# EAGLE design CAMGO (EAGLE 6.6.0)
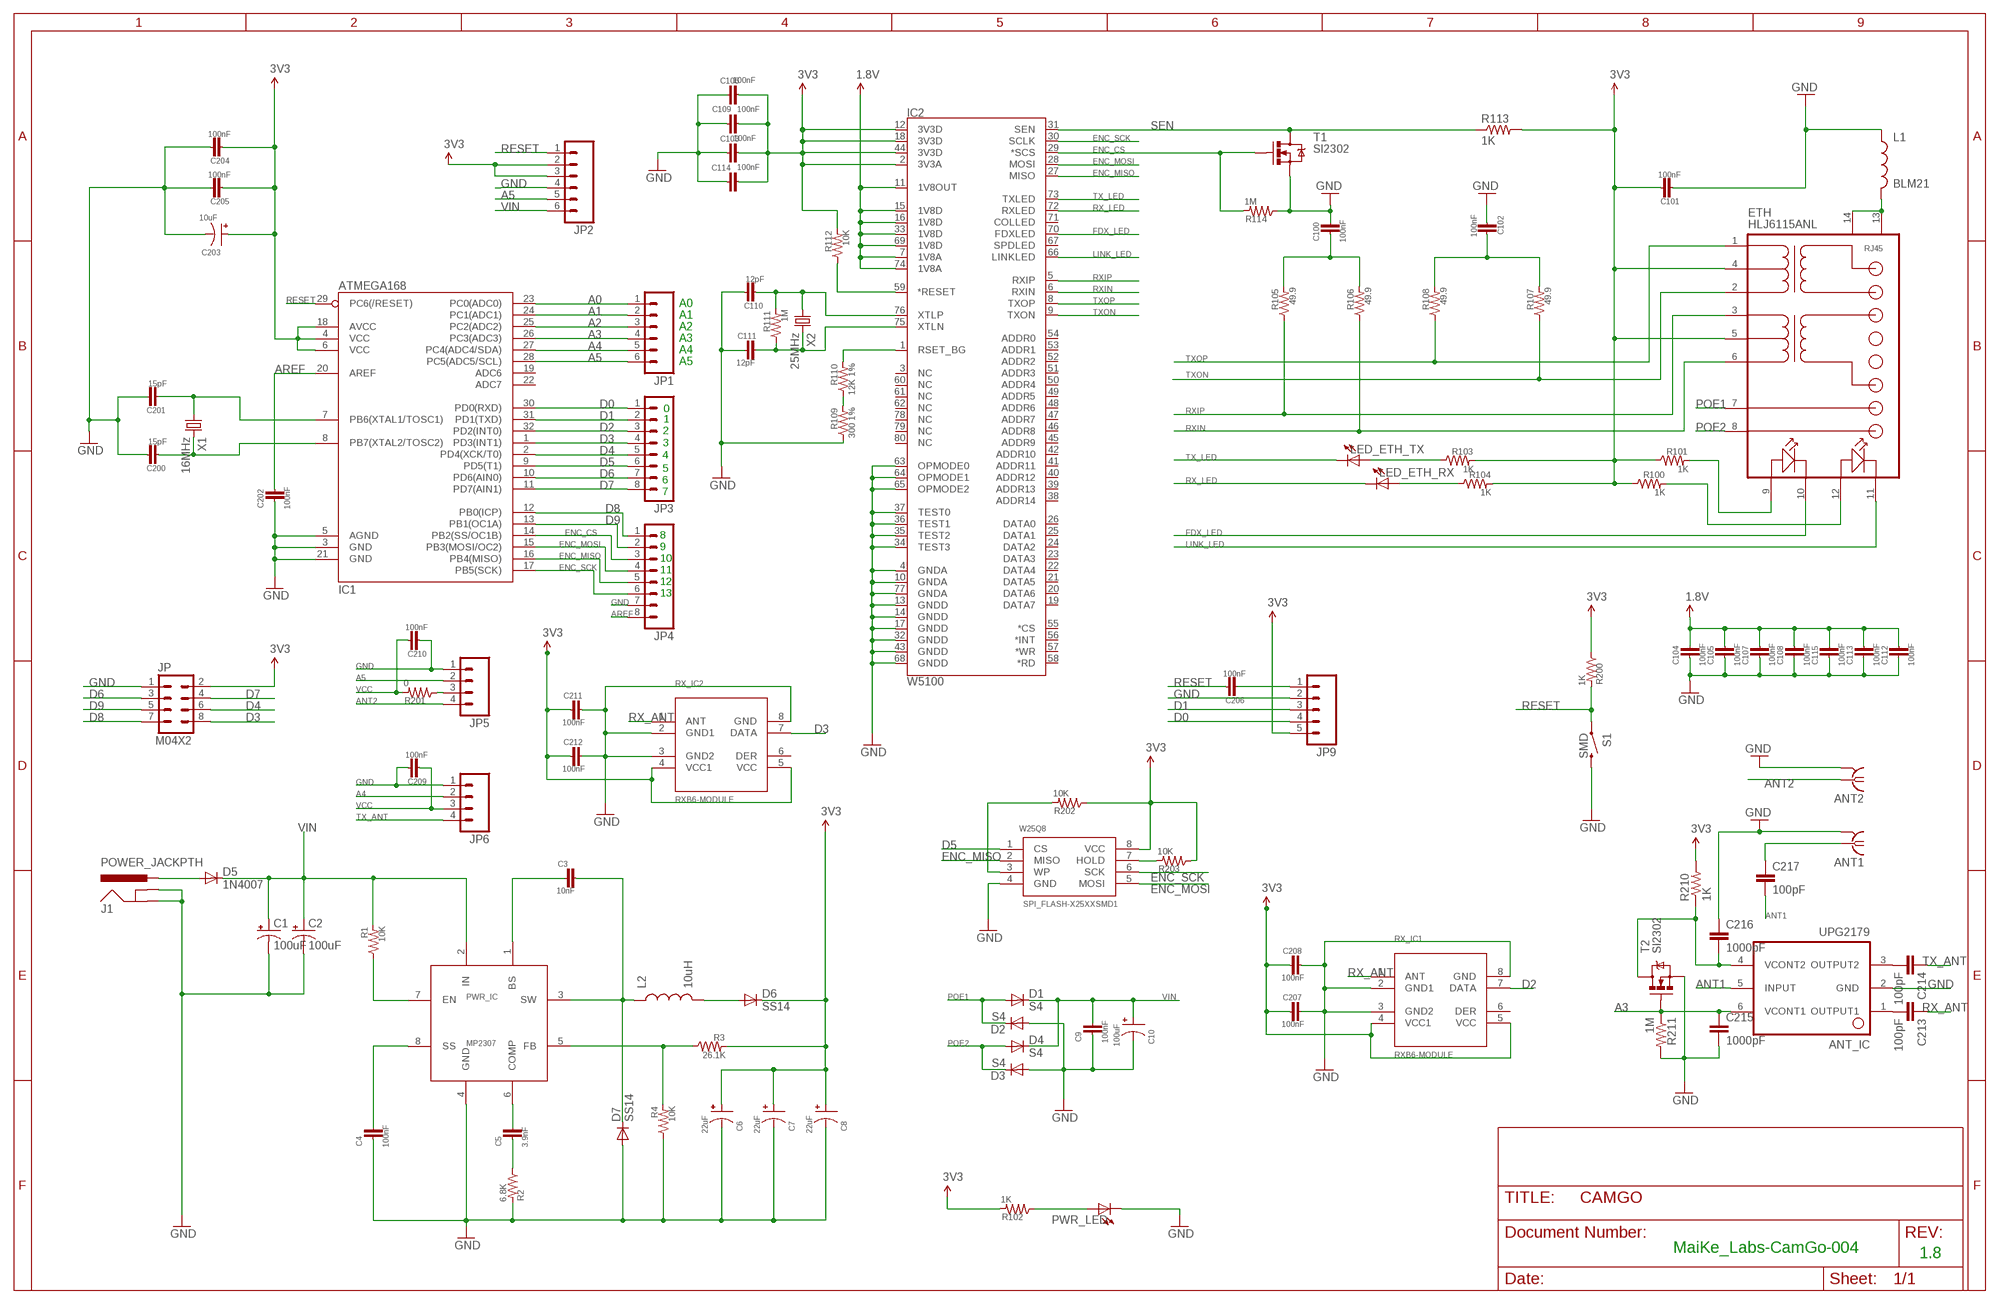
[diagram p0: schematic, sheet 1]

## Parts
ANT1  SMA--KE  [SMA-KE]
ANT2  SMA--KE  [SMA-KE]
ANT_IC  UPG2179  [SOT363]
C1  100uF  CAP_POLF80  [NIPPON_F80]
C2  100uF  CAP_POLF80  [NIPPON_F80]
C3  10nF  CAP0603-CAP  [0603-CAP]
C4  100nF  CAP0603-CAP  [0603-CAP]
C5  3.9nF  CAP0603-CAP  [0603-CAP]
C6  22uF  CAP_POL1206  [EIA3216]
C7  22uF  CAP_POL1206  [EIA3216]
C8  22uF  CAP_POL1206  [EIA3216]
C9  100nF  CAP0603-CAP  [0603-CAP]
C10  100uF  CAP_POLF80  [NIPPON_F80]
C100  100nF  CAP0603-CAP  [0603-CAP]
C101  100nF  CAP0603-CAP  [0603-CAP]
C102  100nF  CAP0603-CAP  [0603-CAP]
C103  100nF  CAP0603-CAP  [0603-CAP]
C104  100nF  CAP0603-CAP  [0603-CAP]
C105  100nF  CAP0603-CAP  [0603-CAP]
C106  100nF  CAP0603-CAP  [0603-CAP]
C107  100nF  CAP0603-CAP  [0603-CAP]
C108  100nF  CAP0603-CAP  [0603-CAP]
C109  100nF  CAP0603-CAP  [0603-CAP]
C110  12pF  CAP0603-CAP  [0603-CAP]
C111  12pF  CAP0603-CAP  [0603-CAP]
C112  100nF  CAP0603-CAP  [0603-CAP]
C113  100nF  CAP0603-CAP  [0603-CAP]
C114  100nF  CAP0603-CAP  [0603-CAP]
C115  100nF  CAP0603-CAP  [0603-CAP]
C200  15pF  CAP0603-CAP  [0603-CAP]
C201  15pF  CAP0603-CAP  [0603-CAP]
C202  100nF  CAP0603-CAP  [0603-CAP]
C203  10uF  CAP_POL1206  [EIA3216]
C204  100nF  CAP0603-CAP  [0603-CAP]
C205  100nF  CAP0603-CAP  [0603-CAP]
C206  100nF  CAP0603-CAP  [0603-CAP]
C207  100nF  CAP0603-CAP  [0603-CAP]
C208  100nF  CAP0603-CAP  [0603-CAP]
C209  100nF  CAP0603-CAP  [0603-CAP]
C210  100nF  CAP0603-CAP  [0603-CAP]
C211  100nF  CAP0603-CAP  [0603-CAP]
C212  100nF  CAP0603-CAP  [0603-CAP]
C213  100pF  CAP0603-CAP  [0603-CAP]
C214  100pF  CAP0603-CAP  [0603-CAP]
C215  1000pF  CAP0603-CAP  [0603-CAP]
C216  1000pF  CAP0603-CAP  [0603-CAP]
C217  100pF  CAP0603-CAP  [0603-CAP]
D1  S4  DIODESOD  [SOD-323]
D2  S4  DIODESOD  [SOD-323]
D3  S4  DIODESOD  [SOD-323]
D4  S4  DIODESOD  [SOD-323]
D5  1N4007  DIODESMB  [SMB-DIODE]
D6  SS14  DIODESOD  [SOD-323]
D7  SS14  DIODESOD  [SOD-323]
ETH  HLJ6115ANL  [HR911105A]
IC1  ATMEGA168  [TQFP32-08]
IC2  W5100  [LQFP-80]
J1  POWER_JACKPTH  [POWER_JACK_PTH]
JP  M04X2  [2X4]
JP1  M06SIP  [1X06]
JP2  M06SIP  [1X06]
JP3  M081X08  [1X08]
JP4  M081X08  [1X08]
JP5  M04PTH  [1X04]
JP6  M04PTH  [1X04]
JP9  M05PTH  [1X05]
L1  BLM21  INDUCTOR0805  [0805]
L2  10uH  INDUCTORCR54  [CR54]
LED_ETH_RX  LED0603  [LED-0603]
LED_ETH_TX  LED0603  [LED-0603]
PWR_IC  MP2307  MP2302  [SOIC8]
PWR_LED  LED0603  [LED-0603]
R1  10K  RESISTOR0603-RES  [0603-RES]
R2  6.8K  RESISTOR0603-RES  [0603-RES]
R3  26.1K  RESISTOR0603-RES  [0603-RES]
R4  10K  RESISTOR0603-RES  [0603-RES]
R100  1K  RESISTOR0603-RES  [0603-RES]
R101  1K  RESISTOR0603-RES  [0603-RES]
R102  1K  RESISTOR0603-RES  [0603-RES]
R103  1K  RESISTOR0603-RES  [0603-RES]
R104  1K  RESISTOR0603-RES  [0603-RES]
R105  49.9  RESISTOR0603-RES  [0603-RES]
R106  49.9  RESISTOR0603-RES  [0603-RES]
R107  49.9  RESISTOR0603-RES  [0603-RES]
R108  49.9  RESISTOR0603-RES  [0603-RES]
R109  300 1%  RESISTOR0603-RES  [0603-RES]
R110  12K 1%  RESISTOR0603-RES  [0603-RES]
R111  1M  RESISTOR0603-RES  [0603-RES]
R112  10K  RESISTOR0603-RES  [0603-RES]
R113  1K  RESISTOR0603-RES  [0603-RES]
R114  1M  RESISTOR0603-RES  [0603-RES]
R200  1K  RESISTOR0603-RES  [0603-RES]
R201  0  RESISTOR0603-RES  [0603-RES]
R202  10K  RESISTOR0603-RES  [0603-RES]
R203  10K  RESISTOR0603-RES  [0603-RES]
R210  1K  RESISTOR0603-RES  [0603-RES]
R211  1M  RESISTOR0603-RES  [0603-RES]
RX_IC1  RXB6-MODULE  [RXB6-MODULE]
RX_IC2  RXB6-MODULE  [RXB6-MODULE]
S1  SMD  SWITCH-MOMENTARY-2-SMD-1101NE  [TACTILE-SWITCH-1101NE]
T1  SI2302  -MOSFET-N-SMD  [SOT23-3]
T2  SI2302  -MOSFET-N-SMD  [SOT23-3]
W25Q8  SPI_FLASH-X25XXSMD1  [SO08-EIAJ]
X1  16MHz  CRYSTALHC49US  [HC49US]
X2  25MHz  CRYSTALHC49US  [HC49US]

## Nets
1.8V: C104.1 C105.1 C107.1 C108.1 C112.1 C113.1 C115.1 IC2.7(1V8A) IC2.11(1V8OUT) IC2.15(1V8D) IC2.16(1V8D) IC2.33(1V8D) IC2.69(1V8D) IC2.74(1V8A)
A0: IC1.23(PC0(ADC0)) JP1.1
A1: IC1.24(PC1(ADC1)) JP1.2
A2: IC1.25(PC2(ADC2)) JP1.3
A3: ANT_IC.6(VCONT1) C215.1 IC1.26(PC3(ADC3)) JP1.4 R211.1 T2.1(G)
A4: IC1.27(PC4(ADC4/SDA)) JP1.5 JP6.2
A5: IC1.28(PC5(ADC5/SCL)) JP1.6 JP2.5 JP5.2
ANT1: ANT_IC.5(INPUT) C217.2
ANT2: ANT2.1 JP5.4
AREF: C202.1 IC1.20(AREF) JP4.8
D0: IC1.30(PD0(RXD)) JP3.1 JP9.4
D1: IC1.31(PD1(TXD)) JP3.2 JP9.3
D2: IC1.32(PD2(INT0)) JP3.3 RX_IC1.7(DATA)
D3: IC1.1(PD3(INT1)) JP3.4 JP.8 RX_IC2.7(DATA)
D4: IC1.2(PD4(XCK/T0)) JP3.5 JP.6
D5: IC1.9(PD5(T1)) JP3.6 W25Q8.1(CS)
D6: IC1.10(PD6(AIN0)) JP3.7 JP.3
D7: IC1.11(PD7(AIN1)) JP3.8 JP.4
D8: IC1.12(PB0(ICP)) JP4.1 JP.7
D9: IC1.13(PB1(OC1A)) JP4.2 JP.5
ENC_CS: IC1.14(PB2(SS/OC1B)) IC2.29(*SCS) JP4.3 R114.2 T1.1(G)
ENC_MISO: IC1.16(PB4(MISO)) IC2.27(MISO) JP4.5 W25Q8.2(MISO)
ENC_MOSI: IC1.15(PB3(MOSI/OC2)) IC2.28(MOSI) JP4.4 W25Q8.5(MOSI)
ENC_SCK: IC1.17(PB5(SCK)) IC2.30(SCLK) JP4.6 W25Q8.6(SCK)
FDX_LED: ETH.10 IC2.70(FDXLED)
GND: ANT1.G@1(GND) ANT2.G@1(GND) ANT_IC.2(GND) C1.- C2.- C4.2 C6.C(-) C7.C(-) C8.C(-) C9.2 C10.- C100.1 C101.2 C102.2 C103.2 C104.2 C105.2 C106.2 C107.2 C108.2 C109.1 C110.1 C111.2 C112.2 C113.2 C114.1 C115.2 C200.1 C201.1 C202.2 C203.C(-) C204.1 C205.1 C207.1 C208.1 C209.1 C210.2 C211.1 C212.1 C215.2 C216.1 D2.2(A) D3.2(A) D7.2(A) IC1.3(GND) IC1.5(AGND) IC1.21(GND) IC2.4(GNDA) IC2.10(GNDA) IC2.13(GNDD) IC2.14(GNDD) IC2.17(GNDD) IC2.32(GNDD) IC2.34(TEST3) IC2.35(TEST2) IC2.36(TEST1) IC2.37(TEST0) IC2.43(GNDD) IC2.63(OPMODE0) IC2.64(OPMODE1) IC2.65(OPMODE2) IC2.68(GNDD) IC2.77(GNDA) J1.GND J1.GNDBREAK JP2.4 JP4.7 JP5.1 JP6.1 JP9.2 JP.1 L1.1 PWR_IC.4(GND) PWR_LED.C R2.2 R4.1 R109.1 R114.1 R211.2 RX_IC1.2(GND1) RX_IC1.3(GND2) RX_IC1.8(GND) RX_IC2.2(GND1) RX_IC2.3(GND2) RX_IC2.8(GND) S1.P$2 T1.2(S) T2.2(S) W25Q8.4(GND)
LINK_LED: ETH.11 IC2.66(LINKLED)
N$1: ETH.9 R101.2
N$2: C201.2 IC1.7(PB6(XTAL1/TOSC1)) X1.1
N$3: C200.2 IC1.8(PB7(XTAL2/TOSC2)) X1.2
N$4: C110.2 IC2.76(XTLP) R111.2 X2.1
N$5: R202.2 W25Q8.3(WP)
N$6: C206.2 JP9.1
N$7: D5.A J1.PWR
N$8: C111.1 IC2.75(XTLN) R111.1 X2.2
N$9: C3.2 PWR_IC.1(BS)
N$10: PWR_IC.7(EN) R1.1
N$11: PWR_LED.A R102.1
N$12: C4.1 PWR_IC.8(SS)
N$13: IC2.1(RSET_BG) R110.2
N$14: R109.2 R110.1
N$15: ETH.12 R100.2
N$16: PWR_IC.5(FB) R3.1 R4.2
N$17: C102.1 R107.2 R108.2
N$18: C5.1 PWR_IC.6(COMP)
N$19: C5.2 R2.1
N$20: C3.1 D7.1(C) L2.P$1 PWR_IC.3(SW)
N$22: LED_ETH_TX.A R103.1
N$23: C100.2 R105.2 R106.2
N$24: LED_ETH_RX.A R104.1
N$28: D6.2(A) L2.P$2
N$34: JP5.3 R201.1
N$35: R203.2 W25Q8.7(HOLD)
N$36: ETH.13 ETH.14 L1.2
N$37: ANT_IC.4(VCONT2) C216.2 R210.1 T2.3(D)
N$38: ANT1.1 C217.1
N$39: ANT_IC.1(OUTPUT1) C213.2
N$40: ANT_IC.3(OUTPUT2) C214.2
POE1: D1.2(A) D2.1(C) ETH.7
POE2: D3.1(C) D4.2(A) ETH.8
RESET: C206.1 IC1.29(PC6(/RESET)) IC2.59(*RESET) JP2.1 R112.1 R200.2 S1.P$1
RX_ANT: C213.1 RX_IC1.1(ANT) RX_IC2.1(ANT)
RX_LED: IC2.72(RXLED) LED_ETH_RX.C
RXIN: ETH.6 IC2.6(RXIN) R106.1
RXIP: ETH.3 IC2.5(RXIP) R105.1
SEN: IC2.31(SEN) R113.1 T1.3(D)
TX_ANT: C214.1 JP6.4
TX_LED: IC2.73(TXLED) LED_ETH_TX.C
TXON: ETH.2 IC2.9(TXON) R107.1
TXOP: ETH.1 IC2.8(TXOP) R108.1
VCC: C6.A(+) C7.A(+) C8.A(+) C101.1 C103.1 C106.1 C109.2 C114.2 C203.A(+) C204.2 C205.2 C207.2 C208.2 C209.2 C210.1 C211.2 C212.2 D6.1(C) ETH.4 ETH.5 IC1.4(VCC) IC1.6(VCC) IC1.18(AVCC) IC2.2(3V3A) IC2.12(3V3D) IC2.18(3V3D) IC2.44(3V3D) JP2.2 JP2.3 JP6.3 JP9.5 JP.2 R3.2 R100.1 R101.1 R102.2 R103.2 R104.2 R112.2 R113.2 R200.1 R201.2 R202.1 R203.1 R210.2 RX_IC1.4(VCC1) RX_IC1.5(VCC) RX_IC2.4(VCC1) RX_IC2.5(VCC) W25Q8.8(VCC) ; supply symbol labelled 3V3
VIN: C1.+ C2.+ C9.1 C10.+ D1.1(C) D4.1(C) D5.C JP2.6 PWR_IC.2(IN) R1.2
Unconnected: IC1.19(ADC6) IC1.22(ADC7) IC2.3(NC) IC2.19(DATA7) IC2.20(DATA6) IC2.21(DATA5) IC2.22(DATA4) IC2.23(DATA3) IC2.24(DATA2) IC2.25(DATA1) IC2.26(DATA0) IC2.38(ADDR14) IC2.39(ADDR13) IC2.40(ADDR12) IC2.41(ADDR11) IC2.42(ADDR10) IC2.45(ADDR9) IC2.46(ADDR8) IC2.47(ADDR7) IC2.48(ADDR6) IC2.49(ADDR5) IC2.50(ADDR4) IC2.51(ADDR3) IC2.52(ADDR2) IC2.53(ADDR1) IC2.54(ADDR0) IC2.55(*CS) IC2.56(*INT) IC2.57(*WR) IC2.58(*RD) IC2.60(NC) IC2.61(NC) IC2.62(NC) IC2.67(SPDLED) IC2.71(COLLED) IC2.78(NC) IC2.79(NC) IC2.80(NC) RX_IC1.6(DER) RX_IC2.6(DER)

## Notes on the sheet
- A0
- A1
- A2
- A3
- A4
- A5
- 0
- 1
- 2
- 3
- 4
- 5
- 6
- 7
- 8
- 9
- 10
- 11
- 12
- 13
- MaiKe_Labs-CamGo-004
- 1.8

## Power pins joined to a net without a drawn wire
GND: ANT1.G@2(GND) ANT1.G@3(GND) ANT1.G@4(GND) ANT2.G@2(GND) ANT2.G@3(GND) ANT2.G@4(GND)

## Library data of the parts
ANT1 ANT2 = dtoy-RF:SMA-: SMA 50 Ohm End Launch Jack Receptacle - Round Contact Johnson Components Source: www.johnsoncomponents.com .. J502-ND.pdf
ANT_IC = ehl:UPG2179
C1 C2 = SparkFun:CAP_POL: Capacitor Polarized
C3-C5 C9 C100-C115 C200-C202 C204-C212 = digital-toy:CAP: Capacitor Standard 0603 ceramic capacitor, and 0.1" leaded capacitor.
C6-C8 C10 C203 = digital-toy:CAP_POL: Capacitor Polarized
C213-C217 = SparkFun:CAP: Capacitor Standard 0603 ceramic capacitor, and 0.1" leaded capacitor.
D1-D4 = ehl:DIODE: Diode These are standard reverse protection diodes and small signal diodes. SMA package can handle up to about 1A. SOD-323 can handle about 200mA. What the SOD-323 package when ordering, there are some mfgs out there that are 5-pin packages.
D5-D7 = SparkFun:DIODE: Diode These are standard reverse protection diodes and small signal diodes. SMA package can handle up to about 1A. SOD-323 can handle about 200mA. What the SOD-323 package when ordering, there are some mfgs out there that are 5-pin packages.
ETH = ehl:HLJ6115ANL
IC1 = SparkFun:ATMEGA168
IC2 = SparkFun:W5100: WIZnet W5100 TCP/IP PHY Embedded Chip See SparkFun catalog # COM-09471 Package: LQFP-80,10x10mm, 0.4mm pitch
J1 = digital-toy:POWER_JACK: Power Jack This is the standard 5.5mm barrel jack for power. The PTH is the most common, proven, reliable, footprint. All others are experimental. The Slot footprint only works if the mill layer is transmitted to the PCB fab house so be warned. Spark Fun Electronics SKU : PRT-00119. Mating wall wart : TOL-00298 (and others)
JP = SparkFun:M04X2
JP1 JP2 = SparkFun:M06: Header 6 Standard 6-pin 0.1" header. Use with straight break away headers (SKU : PRT-00116), right angle break away headers (PRT-00553), swiss pins (PRT-00743), machine pins (PRT-00117), and female headers (PRT-00115). Molex polarized connector foot print use with SKU : PRT-08094 with associated crimp pins and housings. NOTES ON THE VARIANTS LOCK and LOCK_LONGPADS... This footprint was designed to help hold the alignment of a through-hole component (i.e. 6-pin header) while soldering it into place. You may notice that each hole has been shifted either up or down by 0.005 of an inch from it's more standard position (which is a perfectly straight line). This slight alteration caused the pins (the squares in the middle) to touch the edges of the holes. Because they are alternating, it causes a "brace" to hold the component in place. 0.005 has proven to be the perfect amount of "off-center" position when using our standard breakaway headers. Although looks a little odd when you look at the bare footprint, once you have a header in there, the alteration is very hard to notice. Also, if you push a header all the way into place, it is covered up entirely on the bottom side. This idea of altering the position of holes to aid alignment will be further integrated into the Sparkfun Library for other footprints. It can help hold any component with 3 or more connection pins.
JP3 JP4 = SparkFun:M08: Header 8 Standard 8-pin 0.1" header. Use with straight break away headers (SKU : PRT-00116), right angle break away headers (PRT-00553), swiss pins (PRT-00743), machine pins (PRT-00117), and female headers (PRT-00115).
JP5 JP6 = SparkFun:M04: Header 4 Standard 4-pin 0.1" header. Use with straight break away headers (SKU : PRT-00116), right angle break away headers (PRT-00553), swiss pins (PRT-00743), machine pins (PRT-00117), and female headers (PRT-00115). Molex polarized connector foot print use with SKU : PRT-08231 with associated crimp pins and housings. 1MM SMD Version SKU: PRT-10208
JP9 = SparkFun:M05: Header 5 Standard 5-pin 0.1" header. Use with straight break away headers (SKU : PRT-00116), right angle break away headers (PRT-00553), swiss pins (PRT-00743), machine pins (PRT-00117), and female headers (PRT-00115). Molex polarized connector foot print use with SKU : PRT-08230 with associated crimp pins and housings.
L1 L2 = SparkFun:INDUCTOR: Inductors Basic Inductor/Choke - 0603 and 1206. Footprints are not proven and vary greatly between part numbers.
LED_ETH_RX LED_ETH_TX PWR_LED = digital-toy:LED: LEDs Standard schematic elements and footprints for 5mm, 3mm, 1206, and 0603 sized LEDs. 5mm - Spark Fun Electronics SKU : COM-00529 (and others) copy led.lbr 0805 led here, by hyl digital-toy. 2010.6.29
PWR_IC = ehl:MP2302: MP2302 The MP2307 is a monolithic synchronous buck regulator. The device integrates 100mΩ MOSFETS that provide 3A of continuous load current over a wide operating input voltage of 4.75V to 23V. Current mode control provides fast transient response and cycle-by-cycle current limit. FEATURES 3A Continuous Output Current 4A Peak Output Current Wide 4.75V to 23V Operating Input Range Integrated 100mΩ Power MOSFET Switches Output Adjustable from 0.925V to 20V Up to 95% Efficiency Programmable Soft-Start Stable with Low ESR Ceramic Output Capacitors Fixed 340KHz Frequency Cycle-by-Cycle Over Current Protection Input Under Voltage Lockout Thermally Enhanced 8-Pin SOIC Package APPLICATIONS Distributed Power Systems Networking Systems FPGA, DSP, ASIC Power Supplies Green Electronics/Appliances Notebook Computers
R1-R4 R100-R112 R114 R200-R203 = digital-toy:RESISTOR: Resistor
R113 R210 R211 = SparkFun:RESISTOR: Resistor
RX_IC1 RX_IC2 = ehl:RXB6-MODULE
S1 = SparkFun:SWITCH-MOMENTARY-2
T1 T2 = digital-toy:*-MOSFET-N
W25Q8 = SparkFun:SPI_FLASH-X25XX: 8pin SPI Flash series x25xx. Works with devices like W25X32 and BR25L32
X1 X2 = SparkFun:CRYSTAL: Crystals Various standard crystals. Proven footprints. Spark Fun Electronics SKU : COM-00534

## Board
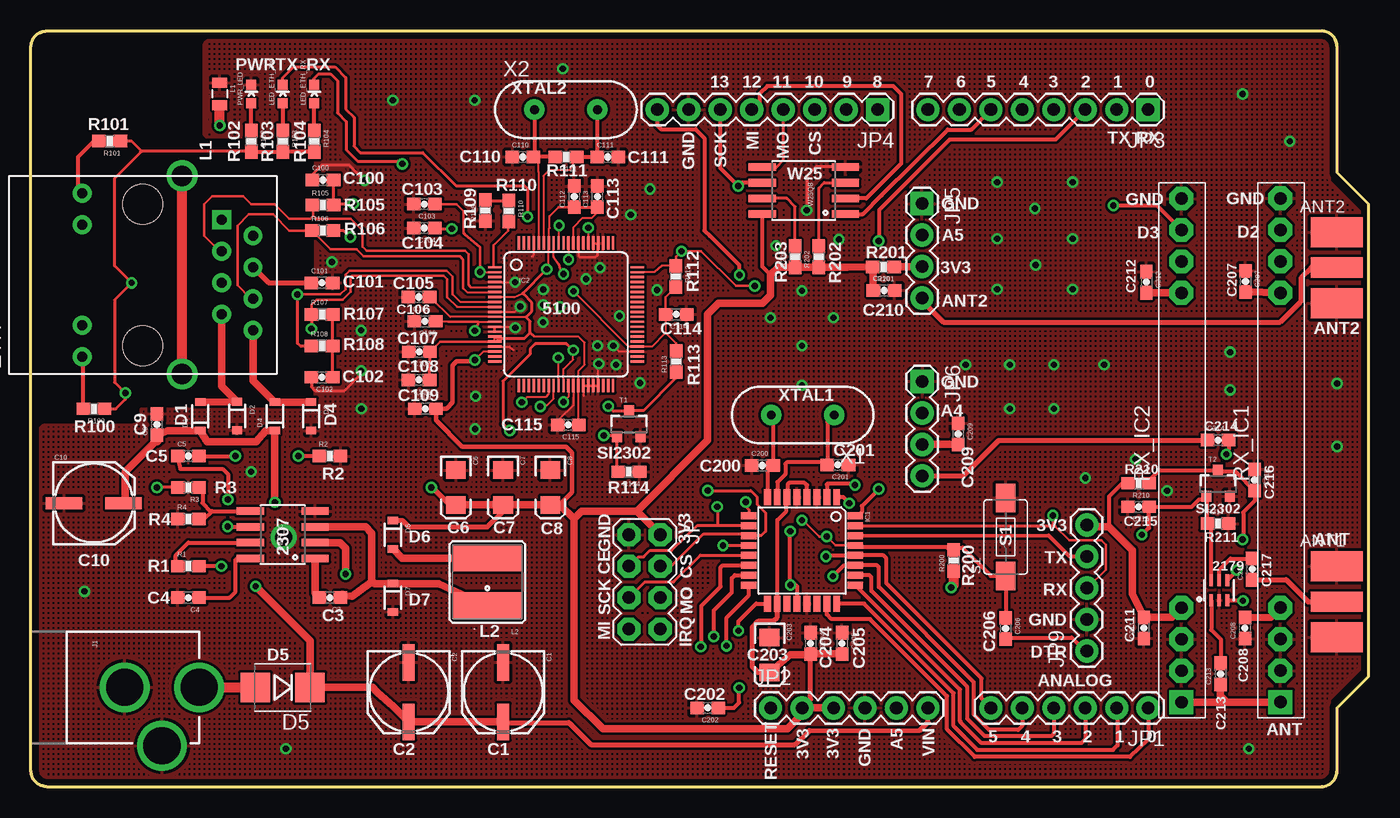
[diagram p1: board, top side]
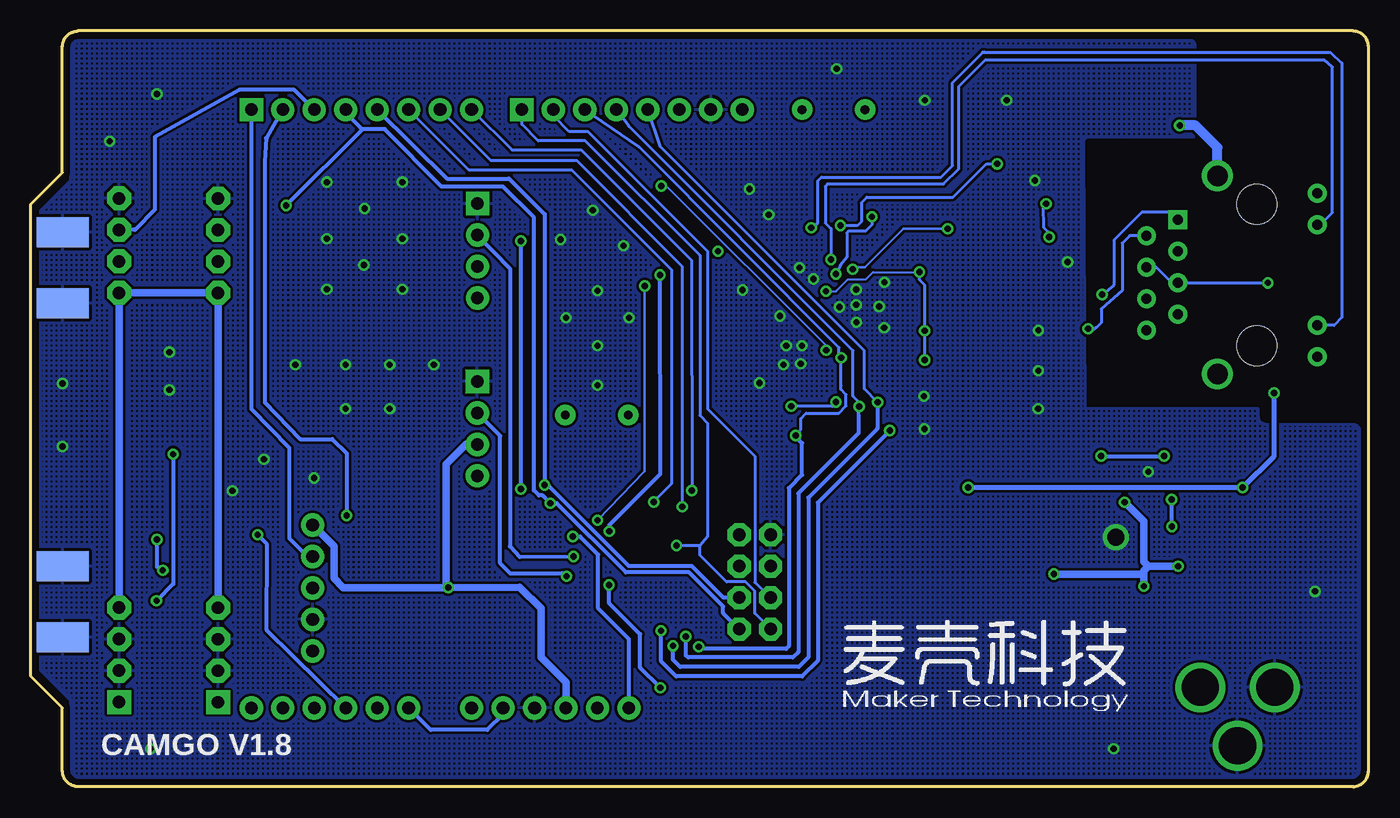
[diagram p2: board, bottom side, seen from below]

Size 107.95 x 60.96 mm. Coordinates in mm from the lower left corner, seen from the top.
Outline: 1.27,0 arc-90 0,1.27 0,59.69 arc-90 1.27,60.96 104.14,60.96 arc-90 105.41,59.69 105.41,49.53 107.95,46.99 107.95,8.89 105.41,6.35 105.41,1.27 arc-90 104.14,0 1.27,0
Copper layers (1*16): Top 0.035mm / dielectric 1.5mm / Bottom 0.035mm
Design rules "jackslab-camgo *": minimum track width 6mil, minimum drill 12mil, track to track 8mil, track to pad 8mil, pad to pad 8mil, via to via 8mil, smd to smd 6mil, copper to edge 20mil, drill to drill 8mil, minimum pad ring 10mil, minimum via ring 8mil, stop-mask expansion 0mil, vias tented up to drill 30mil, thermal gap 10mil

### Footprints (pad centres in the part's own frame; a part is rotated, then mirrored left to right if it is on the bottom)
SMA-KE = smd 4.191 x 1.651: 1 -2.115,0 | smd 4.191 x 2.413: G@1 -2.115,-2.86; G@2 -2.115,2.86 | smd 4.191 x 2.413 bottom: G@3 -2.115,-2.86; G@4 -2.115,2.86
SOT363 = smd 0.3 x 0.99: 1 -0.65,-0.8; 2 0,-0.8; 3 0.65,-0.8; 4 0.65,0.81; 5 0,0.81; 6 -0.65,0.81
NIPPON_F80 = smd 2.95 x 1: + 2.4,0; - -2.4,0
0603-CAP = smd 1.1 x 1: 1 -0.85,0; 2 0.85,0
EIA3216 = smd 1.4 x 1.6: A 1.4,0; C -1.4,0
SOD-323 = smd 0.63 x 0.83: 1 -1.15,0; 2 1.15,0
SMB-DIODE = smd 2.4 x 2.4: A 2.2,0; C -2.2,0
HR911105A = drill 0.813 pad 1.524 square: 1 4.445,-6.35 | drill 0.813 pad 1.524: 2 3.175,-8.89; 3 1.905,-6.35; 4 0.635,-8.89; 5 -0.635,-6.35; 6 -1.905,-8.89; 7 -3.175,-6.35; 8 -4.445,-8.89; 9 6.604,4.902; 10 4.064,4.902; 11 -4.064,4.902; 12 -6.604,4.902 | drill 1.651 pad 2.159: 13 8.001,-3.175; 14 -8.001,-3.175 | hole 3.2: 5.715,0; -5.715,0
TQFP32-08 = smd 1.27 x 0.559: 1 -4.293,2.8; 2 -4.293,2; 3 -4.293,1.2; 4 -4.293,0.4; 5 -4.293,-0.4; 6 -4.293,-1.2; 7 -4.293,-2; 8 -4.293,-2.8; 17 4.293,-2.8; 18 4.293,-2; 19 4.293,-1.2; 20 4.293,-0.4; 21 4.293,0.4; 22 4.293,1.2; 23 4.293,2; 24 4.293,2.8 | smd 0.559 x 1.27: 9 -2.8,-4.293; 10 -2,-4.293; 11 -1.2,-4.293; 12 -0.4,-4.293; 13 0.4,-4.293; 14 1.2,-4.293; 15 2,-4.293; 16 2.8,-4.293; 25 2.8,4.293; 26 2,4.293; 27 1.2,4.293; 28 0.4,4.293; 29 -0.4,4.293; 30 -1.2,4.293; 31 -2,4.293; 32 -2.8,4.293
LQFP-80 = smd 0.19 x 1.1: 1 -3.8,-5.75; 2 -3.4,-5.75; 3 -3,-5.75; 4 -2.6,-5.75; 5 -2.2,-5.75; 6 -1.8,-5.75; 7 -1.4,-5.75; 8 -1,-5.75; 9 -0.6,-5.75; 10 -0.2,-5.75; 11 0.2,-5.75; 12 0.6,-5.75; 13 1,-5.75; 14 1.4,-5.75; 15 1.8,-5.75; 16 2.2,-5.75; 17 2.6,-5.75; 18 3,-5.75; 19 3.4,-5.75; 20 3.8,-5.75; 41 3.8,5.75; 42 3.4,5.75; 43 3,5.75; 44 2.6,5.75; 45 2.2,5.75; 46 1.8,5.75; 47 1.4,5.75; 48 1,5.75; 49 0.6,5.75; 50 0.2,5.75; 51 -0.2,5.75; 52 -0.6,5.75; 53 -1,5.75; 54 -1.4,5.75; 55 -1.8,5.75; 56 -2.2,5.75; 57 -2.6,5.75; 58 -3,5.75; 59 -3.4,5.75; 60 -3.8,5.75 | smd 1.1 x 0.19: 21 5.75,-3.8; 22 5.75,-3.4; 23 5.75,-3; 24 5.75,-2.6; 25 5.75,-2.2; 26 5.75,-1.8; 27 5.75,-1.4; 28 5.75,-1; 29 5.75,-0.6; 30 5.75,-0.2; 31 5.75,0.2; 32 5.75,0.6; 33 5.75,1; 34 5.75,1.4; 35 5.75,1.8; 36 5.75,2.2; 37 5.75,2.6; 38 5.75,3; 39 5.75,3.4; 40 5.75,3.8; 61 -5.75,3.8; 62 -5.75,3.4; 63 -5.75,3; 64 -5.75,2.6; 65 -5.75,2.2; 66 -5.75,1.8; 67 -5.75,1.4; 68 -5.75,1; 69 -5.75,0.6; 70 -5.75,0.2; 71 -5.75,-0.2; 72 -5.75,-0.6; 73 -5.75,-1; 74 -5.75,-1.4; 75 -5.75,-1.8; 76 -5.75,-2.2; 77 -5.75,-2.6; 78 -5.75,-3; 79 -5.75,-3.4; 80 -5.75,-3.8
POWER_JACK_PTH = drill 2.997: GND 0,7.7; GNDBREAK 4.7,10.7; PWR 0,13.7
2X4 = drill 1.016 pad 1.88 octagon: 1 -3.81,-1.27; 2 -3.81,1.27; 3 -1.27,-1.27; 4 -1.27,1.27; 5 1.27,-1.27; 6 1.27,1.27; 7 3.81,-1.27; 8 3.81,1.27
1X06 = drill 1.016 pad 1.88: 1 0,0; 2 2.54,0; 3 5.08,0; 4 7.62,0; 5 10.16,0; 6 12.7,0
1X08 = drill 1.016 pad 1.88 square: 1 0,0 | drill 1.016 pad 1.88: 2 2.54,0; 3 5.08,0; 4 7.62,0; 5 10.16,0; 6 12.7,0; 7 15.24,0; 8 17.78,0
1X04 = drill 1.016 pad 1.88 square: 1 0,0 | drill 1.016 pad 1.88: 2 2.54,0; 3 5.08,0; 4 7.62,0
1X05 = drill 1.016 pad 1.88: 1 0,0; 2 2.54,0; 3 5.08,0; 4 7.62,0; 5 10.16,0
0805 = smd 0.8 x 1.2: 1 -0.9,0; 2 0.9,0
CR54 = smd 5.5 x 2.15: P$1 0,1.92; P$2 0,-1.92
LED-0603 = smd 0.8 x 0.8: A 0,-0.75; C 0,0.75
SOIC8 = smd 0.61 x 2.21: 1 -1.905,-2.616; 2 -0.635,-2.616; 3 0.635,-2.616; 4 1.905,-2.616; 5 1.905,2.616; 6 0.635,2.616; 7 -0.635,2.616; 8 -1.905,2.616
0603-RES = smd 1.1 x 1: 1 -0.85,0; 2 0.85,0
RXB6-MODULE = drill 1 pad 1.93 square: 1 -20.32,0 | drill 1 pad 1.93 octagon: 2 -17.78,0; 3 -15.24,0; 4 -12.7,0; 5 12.7,0; 6 15.24,0; 7 17.78,0; 8 20.32,0
TACTILE-SWITCH-1101NE = smd 2.3 x 1.6: P$1 -3.15,0; P$2 3.15,0
SOT23-3 = smd 0.8 x 0.9: 1 -0.95,-1; 2 0.95,-1; 3 0,1.1
SO08-EIAJ = smd 0.61 x 2.21: 1 -1.905,-3.378; 2 -0.635,-3.378; 3 0.635,-3.378; 4 1.905,-3.378; 5 1.905,3.353; 6 0.635,3.353; 7 -0.635,3.353; 8 -1.905,3.353
HC49US = drill 0.7 pad 1.651: 1 -2.54,0; 2 2.54,0

### Placement (x,y rotation side)
ANT1  107.49,14.91 0 top
ANT2  107.49,41.87 0 top
ANT_IC  95.9,15.83 0 top
C1  38.1,7.62 270 top
C2  30.48,7.62 270 top
C3  24.13,15.24 180 top
C4  12.7,15.24 180 top
C5  12.7,26.67 0 top
C6  34.29,24.13 270 top
C7  38.1,24.13 270 top
C8  41.91,24.13 270 top
C9  10.16,29.21 90 top
C10  5.08,22.86 0 top
C100  23.57,48.95 0 top
C101  23.5,40.64 0 top
C102  23.5,33.02 180 top
C103  31.75,46.99 180 top
C104  31.75,45.06 180 top
C105  31.32,39.5 180 top
C106  31.8,37.54 180 top
C107  31.34,35.08 180 top
C108  31.32,32.82 180 top
C109  31.83,30.48 0 top
C110  39.7,50.8 0 top
C111  46.56,50.8 0 top
C112  43.84,47.6 90 top
C113  45.72,47.6 90 top
C114  52.07,38.1 180 top
C115  43.36,29.18 180 top
C200  59.03,25.91 0 top
C201  65.13,25.96 180 top
C202  54.61,6.35 180 top
C203  59.61,10.62 270 top
C204  62.92,11.56 270 top
C205  65.46,11.56 270 top
C206  78.66,12.75 270 top
C207  98.02,40.76 270 top
C208  97.97,12.78 90 top
C209  74.83,28.45 270 top
C210  68.85,40.03 0 top
C211  89.81,12.8 90 top
C212  90.02,40.69 270 top
C213  96,9.1 90 top
C214  95.82,27.95 0 top
C215  89.39,22.58 180 top
C216  98.74,24.74 270 top
C217  98.56,17.54 90 top
D1  13.67,29.87 90 top
D2  16.64,29.9 270 top
D3  22.61,29.87 270 top
D4  19.68,29.87 90 top
D5  20.32,8 180 top
D6  29.21,20.32 270 top
D7  29.21,15.24 270 top
ETH  9.03,41.27 90 top
IC1  62.23,19.05 270 top
IC2  43.18,38.1 270 top
J1  -0.13,8 270 top
JP  49.53,16.51 270 top
JP1  90.17,6.35 180 top
JP2  59.69,6.35 0 top
JP3  90.17,54.61 180 top
JP4  68.33,54.61 180 top
JP5  71.91,47.03 270 top
JP6  71.93,32.69 270 top
JP9  85.22,10.95 90 top
L1  15.24,55.88 270 top
L2  36.83,16.51 180 top
LED_ETH_RX  22.86,55.88 0 top
LED_ETH_TX  20.32,55.88 0 top
PWR_IC  20.32,20.32 90 top
PWR_LED  17.78,55.88 0 top
R1  12.7,17.78 0 top
R2  24.13,26.67 0 top
R3  12.7,24.13 180 top
R4  12.7,21.59 0 top
R100  5.08,30.48 180 top
R101  6.35,52.07 180 top
R102  17.78,52.07 270 top
R103  20.32,52.07 270 top
R104  22.86,52.07 270 top
R105  23.57,46.91 0 top
R106  23.55,44.86 0 top
R107  23.5,38.1 0 top
R108  23.5,35.56 0 top
R109  36.68,46.48 90 top
R110  38.56,46.43 270 top
R111  43.18,50.8 180 top
R112  52.04,41.15 270 top
R113  52.07,34.29 90 top
R114  48.26,25.4 180 top
R200  74.47,18.24 90 top
R201  68.8,41.93 180 top
R202  63.58,42.75 90 top
R203  61.67,42.75 90 top
R210  89.4,24.47 180 top
R211  95.8,21.22 0 top
RX_IC1  100.84,27.13 90 top
RX_IC2  92.85,27.12 90 top
S1  78.66,20.14 90 top
T1  48.26,29.21 0 top
T2  95.8,24.42 0 top
W25Q8  62.36,48.08 90 top
X1  62.28,29.97 180 top
X2  43.18,54.61 0 top

### Tracks (layer width: path | path; a pad name or v marks a point on that pad's centre or on a via)
1.8V  (via drill 0.51)
  Top 0.152: 38.99,39.5
  Top 0.178: 41.78,41.88 IC2.74 41.78,45 41.86,45.08 41.86,46.02 | IC2.16 IC2.15 37.59,36.14 | 39.93,37.9 IC2.11 33.83,37.9 32.33,39.37 | 45.72,46.33 45.26,45.87 44.53,45.87 43.79,45.14 IC2.69 | 40.59,36.32 44.17,36.32 44.68,35.81 44.68,34.04 44.18,33.54 IC2.33 44.18,29.36 | IC2.7 38.99,39.5 | 38.99,39.5 39.7,39.8
  Top 0.203: 41.86,46.02 42.58,46.75 C112.1 | 40.28,36.63 40.59,36.32 | IC2.16 33.02,35.9 C107.1 | 32.33,39.37 32.17,39.37 C105.1
  Top 0.254: 41.78,41.88 v41.63,41.73 39.7,39.8 39.75,39.75 40.44,39.01 40.44,38.35 39.98,37.9 39.93,37.9 40.28,37.54 40.28,36.63 39.8,36.14 37.59,36.14 | C104.1 32.65,45.01 v33.96,45.01 | C112.1 C113.1 45.72,46.33 | C115.1 44.18,29.36 | C108.1 C107.1
  Bottom 0.203: v33.96,45.01 37.54,45.01 40.64,41.91 41.45,41.91 v41.63,41.73
A0
  Top 0.305: JP1.1 90.17,3.81 88.7,2.39 76.17,2.39 73.94,4.62 73.94,7.29 67.72,13.51 64.62,13.51 64.23,13.9 IC1.23
A1
  Top 0.305: JP1.2 87.68,6.3 87.68,3.33 87.33,2.97 87.33,2.95 76.38,2.95 76.38,2.97 74.45,4.9 74.45,7.54 67.23,14.76 IC1.24
A2
  Top 0.305: JP1.3 85.09,3.81 84.78,3.5 76.71,3.5 75.03,5.18 75.03,5.23 74.98,5.28 74.98,7.82 66.55,16.25 IC1.25
A3  (via drill 0.5)
  Top 0.305: JP1.4 82.55,4.27 82.35,4.06 76.99,4.06 75.56,5.49 75.56,8.05 67.82,15.8 67.82,16.89 67.66,17.05 IC1.26 | ANT_IC.6 95.25,20.92 R211.1 94.95,23.32 T2.1 94.6,23.16 94.28,23.16 93.7,22.58 C215.1 90.22,22.56 90.22,20.88 v89.66,20.32
  Bottom 0.305: JP1.4 88.92,12.62 88.9,19.53 v89.66,20.32
A4  (via drill 0.51)
  Top 0.305: JP1.5 80.01,4.9 79.68,4.57 77.32,4.57 76.12,5.77 76.12,5.84 76.1,5.87 76.1,8.43 68.43,16.1 68.43,17.7 68.28,17.85 IC1.27 65.6,17.85 v64.72,16.97
  Bottom 0.305: v64.72,16.97 64.82,16.97 65.08,17.22 69.27,17.2 70.08,18.01 70.08,28.3 JP6.2
A5  (via drill 0.51)
  Top 0.305: JP1.6 76.71,7.11 76.71,8.74 69.04,16.41 69.04,18.41 68.8,18.65 IC1.28 64.24,18.65 v64.16,18.57
  Bottom 0.305: v64.16,18.57 68.5,18.54 69.29,19.38 69.29,41.8 JP5.2 | JP2.5 69.85,5.84 71.12,4.57 75.69,4.57 JP1.6
ANT1
  Top 0.305: ANT_IC.5 95.9,17.49 96.8,18.39 C217.2
ANT2
  Top 0.406: 105.16,41.66 ANT2.1 103.33,41.86 102.54,41.07 102.54,39.19 102.39,39.05 102.39,39.04 100.82,37.47 73.66,37.47 71.91,39.21 JP5.4
AREF  (via drill 0.51)
  Top 0.203: v61.29,16.26 61.29,16.2
  Top 0.305: C202.1 56.72,6.35 57.15,6.78 v57.15,7.98 | v61.29,16.26 61.39,16.36 61.62,16.36 61.83,16.15 IC1.20 | 61.27,16.23 v61.27,20.6 | JP4.8 50.55,53.34 50.85,53.03 53.65,53.03 54.36,52.32 54.36,44.86 54.79,44.42 57.15,42.09 v57.17,41.27
  Top 0.406: 61.29,16.2 61.27,16.23
  Bottom 0.305: v57.15,7.98 58.78,9.6 58.78,12.29 61.29,14.81 v61.29,16.26 | v57.17,41.27 57.15,25.22 61.27,21.11 v61.27,20.6
D0
  Top 0.305: IC1.30 66.54,20.27 82.14,20.24 83.82,18.57 JP9.4
  Bottom 0.305: JP3.1 90.17,30.48 87.1,27.33 87.1,20.02 85.65,18.57 JP9.4
D1  (via drill 0.51)
  Top 0.203: 82.65,21.01 83.8,19.86 86.39,19.86 86.74,19.51 86.74,17.5 85.27,16.03 JP9.3
  Top 0.229: 82.47,21.01 82.65,21.01
  Top 0.254: 66.54,21.03 82.45,21.03 | 82.45,21.03 82.47,21.01 | v82.47,21.87 82.47,21.06 82.45,21.03
  Top 0.305: IC1.31 66.54,21.03
  Bottom 0.305: JP3.2 88.92,52.32 88.98,52.32 89.08,50.42 89.08,30.99 86.21,28.04 83.64,28.04 82.47,26.87 v82.47,21.87
D2  (via drill 0.51)
  Top 0.305: JP3.3 82.68,52.2 74.14,52.2 68.45,46.51 v68.43,44.01 | v68.43,24 67.06,22.63 67.06,22.15 66.76,21.85 IC1.32
  Bottom 0.305: v68.43,44.01 v68.43,24 | JP3.3 86.69,56.21 91.16,56.21 97.96,52.41 97.94,46.54 99.55,44.91 RX_IC1.7
D3  (via drill 0.5, 0.51)
  Top 0.305: IC1.1 65.56,23.34 v66.04,22.86 | v87.35,46.89 90.86,46.89 RX_IC2.7
  Bottom 0.305: JP.8 52.09,13.99 52.09,14.53 54.84,17.27 59.94,17.27 65.53,22.86 v66.04,22.86 66.67,23.5 66.95,23.5 67.36,23.9 67.36,45.92 69.85,48.41 74.83,48.41 79.4,53.03 81.23,53.03 | 81.23,53.03 82.55,54.36 JP3.4 | 81.23,53.03 81.23,53.01 v87.35,46.89
D4  (via drill 0.51)
  Top 0.305: v66.5,24.33 66.4,24.43 64.31,24.43 64.23,24.35 IC1.2
  Bottom 0.254: 66.24,24.33 v66.5,24.33
  Bottom 0.305: JP3.5 74.37,49.05 69.37,49.05 66.5,46.18 v66.5,24.33 | JP.6 52.07,15.24 54.61,17.78 59.69,17.78 66.24,24.33
D5  (via drill 0.51)
  Top 0.254: 57.71,22.94 v57.68,22.96 57.68,22.61 57.94,22.35 IC1.9
  Top 0.305: JP3.6 75.89,53.01 73.99,53.01 68.66,47.7 67.13,46.18 W25Q8.1
  Bottom 0.254: JP3.6 72.62,49.76 64.31,49.76 56.26,41.71 56.26,24.43 57.68,23.01 v57.68,22.96
D6  (via drill 0.51)
  Top 0.254: 55.42,21.08 53.8,21.08 51.71,19.05 49.96,19.05 49.45,18.54 49.02,18.54 JP.3 | 55.42,21.08 57.45,21.08 57.51,21.05 IC1.10 | v55.4,22.58 55.42,22.55 55.42,21.08
  Bottom 0.254: JP3.7 70.84,50.52 63.91,50.52 55.4,41.96 v55.4,22.58
D7  (via drill 0.51)
  Top 0.254: JP.4 51.66,17.78 54.28,20.4 57.4,20.4 57.55,20.25 IC1.11 58.93,20.25 59.28,20.6 59.28,22.07 58.6,22.76 58.6,23.37 58.09,23.88 v54.61,23.88
  Bottom 0.254: JP3.8 69.14,51.36 63.55,51.36 54.63,42.44 v54.61,23.88
D8  (via drill 0.51)
  Top 0.254: v55.85,19.46 IC1.12
  Bottom 0.254: v55.85,19.46 53.95,19.46 | 53.95,19.46 53.34,20.19 53.34,29.31 53.98,29.95 53.98,42.85 63.22,52.09 67,52.09 68.33,53.42 JP4.1 | JP.7 49.53,13.97 49.53,15.77 50.27,16.51 51.82,16.51 53.95,18.64 53.95,19.46
D9
  Top 0.254: JP.5 49.55,16.51 51.87,16.51 54.03,18.67 57.56,18.67 IC1.13
  Bottom 0.254: JP.5 48.28,15.24 49.53,16.48 49.53,26.67 53.34,30.48 53.34,43.18 62.99,52.83 64.52,52.83 65.79,54.1
  Bottom 0.305: 65.79,54.1 JP4.2
ENC_CS  (via drill 0.51)
  Top 0.152: IC2.29 v42.57,34.59
  Top 0.254: R114.2 47.31,25.5 T1.1 47.2,28.32 v46.23,28.32
  Top 0.305: IC1.14 55.82,17.85 55.65,17.68 55.65,16.13 54.1,14.58 54.1,11.33 v54.05,11.28
  Bottom 0.254: JP4.3 58.88,51.61 42.72,35.41 42.72,34.75 v42.57,34.59 IC2.29 42.58,32.04 42.16,31.62 42.16,30.71 42.75,30.12 45.39,30.12 45.82,29.69 45.82,28.85 v46.23,28.32
  Bottom 0.305: v46.23,28.32 46.23,28.22 45.72,27.71 45.72,25.15 46.79,24.08 46.79,11.33 47.02,11.1 53.92,11.1 54.05,11.23 v54.05,11.28
ENC_MISO  (via drill 0.51)
  Top 0.152: IC2.27
  Top 0.178: IC2.27 41.78,31.67 41.53,31.42 40.03,31.42 v39.62,31.01
  Top 0.305: v56.13,11.35 56.13,13.64 57.94,15.44 IC1.16 | JP4.5 58.8,55.24 58.8,55.88 59.44,56.52 69.6,56.52 70.23,55.88 70.23,50.27 67.41,47.45 W25Q8.2
  Bottom 0.254: v39.62,31.01 40.69,32.08 40.69,35.18 57.15,51.64 JP4.5 | v39.62,31.01 39.65,30.99 | 39.6,31.04 v39.62,31.01
  Bottom 0.305: 39.65,30.99 39.65,28.88 45.21,23.32 45.21,10.41 45.97,9.65 55.55,9.65 56.13,10.24 v56.13,11.35
ENC_MOSI  (via drill 0.51)
  Top 0.178: v41.1,30.66 41.4,30.73 41.63,30.73 42.19,31.29 IC2.28
  Top 0.254: v55.09,12.12 55.12,12.14 | JP4.4 60.71,50.52 60.15,49.96 59.03,49.96 W25Q8.5
  Top 0.305: 55.12,12.14 55.12,14.22 56.57,15.67 56.57,16.82 56.8,17.05 IC1.15
  Bottom 0.254: v41.1,30.66 41.15,30.48 41.15,29.95 41.17,29.97 41.17,31.06 41.6,31.5 41.6,35.18 59.69,53.26 JP4.4
  Bottom 0.305: 41.15,29.95 41.15,28.52 46.02,23.65 46.02,10.85 46.46,10.41 54.91,10.41 55.09,10.59 v55.09,12.12
ENC_SCK  (via drill 0.51)
  Top 0.178: IC2.30 42.98,33.68 43.54,34.24 43.56,34.24 43.76,34.44 v43.76,35.2
  Top 0.203: v43.76,35.2 43.76,35.08 43.74,35.05
  Top 0.254: 43.74,34.92 43.74,35.05 43.74,35.18 43.2,35.71 40.69,35.71 40.28,35.31 40.28,34.9 38.1,32.72 38.1,29.26 v38.63,28.73
  Top 0.305: v57.1,12.57 57.1,13.34 58.52,14.76 IC1.17 | JP4.6 55.63,49.91 v57.07,48.46 57.33,48.72 W25Q8.6
  Bottom 0.203: v43.76,35.2 43.76,35.56 56.69,48.49 57.1,48.49 v57.07,48.46
  Bottom 0.305: v38.63,28.73 44.45,22.91 44.45,10.16 45.72,8.89 55.88,8.89 57.1,10.11 v57.1,12.57
FDX_LED  (via drill 0.51)
  Top 0.152: IC2.70
  Top 0.178: IC2.70 v43.38,42.52
  Bottom 0.254: 43.38,42.47 v43.38,42.52 43.38,45.01 43.84,45.47 43.84,48.41 43.64,48.62 34.29,48.62 33.07,49.84 33.07,56.49 30.94,58.62 3.58,58.62 2.92,58.06 2.92,46.3 3.89,45.34 ETH.10
GND  (via drill 0.5, 1.4)
  Top 0.152: IC2.32 43.78,30.77 42.67,29.67 42.67,29.35 C115.2
  Top 0.178: IC2.13 38.99,37.1 | IC2.65 45.72,43.85 | IC2.10 39.06,38.3 v39.5,38.73 | IC2.37 45.78,34.07 | IC2.17 38.64,35.5 38.91,35.23 | IC2.77 40.58,42.89 40.44,42.75 | IC2.4 39.06,40.7 | IC2.43 47.45,35.1 v46.99,35.56 | IC2.34 44.6,31.52 | IC2.68 44.18,42.84 44.32,42.7
  Top 0.203: 45.72,43.85 45.72,42.88 45.54,42.7 44.32,42.7 | IC2.34 IC2.36 IC2.37 | 45.78,34.07 v45.82,34.11 | IC2.14 IC2.13 | 39.06,40.7 v39.06,40.69
  Top 0.254: 38.99,37.1 v39.09,37.01 | W25Q8.4 63.35,49.99 62.64,49.28 62.64,46.53 v62.61,46.51 | C100.1 22.72,49.39 23.5,50.16 25.65,50.16 v26.92,48.9 | C102.2 22.64,32.24 22.94,31.95 25.3,31.95 26.64,33.3 v26.64,33.55
  Bottom 0.203: v45.82,34.11 45.85,34.14
  Bottom 0.254: v39.09,37.01 39.37,37.08 | v62.61,46.51 62.61,46.38
  other vias: 24.28,42.32 20.4,20.12 26.64,36.8 35.84,28.85 35.89,31.5 26.67,30.48 17.78,25.4 62.23,32.38 97.79,55.88 101.6,52.07 41.35,40.11 41.35,38.86 41.33,37.47 42.7,38.68 48.41,46.13 44.81,40.94 45.92,41.86 47.5,37.97 49.15,32.56 45.72,35.56 47.22,34.04 77.98,48.77 78.99,30.48 81.03,46.63 77.98,44.2 84.07,44.2 84.07,48.77 77.98,40.13 84.07,40.13 75.44,34.04 78.99,34.04 82.55,34.04 86.61,34.04 82.55,30.48 62.23,40.01 59.69,37.82 62.23,35.56 96.77,35.05 96.77,32 105.41,32.51 105.41,27.43 98.3,3.05 81.08,42.09 49.96,48.21 20.57,3.05 42.93,57.91 4.32,15.75 29.21,55.37 35.81,55.37 85.09,24.89 89.15,26.42 91.69,23.88 50.52,40.06 64.77,37.82 65.2,44.15 60.12,43.64
  pour Top (hatched): 14.61,60.33 104.14,60.33 arc-90 104.78,59.69 104.78,48.9 107.31,46.35 107.31,9.53 104.78,6.99 104.78,1.27 arc-90 104.14,0.64 1.27,0.64 arc-90 0.64,1.27 0.64,28.57 arc-90 1.27,29.21 8.26,29.21 arc90 8.89,29.84 8.89,30.48 22.94,30.51 22.99,51.92 arc90 22.76,52.4 14.17,52.4 arc-90 14,52.7 13.97,59.69 arc-90
  pour Bottom (hatched): 14.61,60.33 104.14,60.33 arc-90 104.78,59.69 104.78,48.9 107.31,46.35 107.31,9.53 104.78,6.99 104.78,1.27 arc-90 104.14,0.64 1.27,0.64 arc-90 0.64,1.27 0.64,28.57 arc-90 1.27,29.21 8.26,29.21 arc90 8.89,29.84 8.89,30.48 22.86,30.48 22.99,51.89 arc90 22.73,52.37 14.07,52.43 arc-90 13.97,52.7 13.97,59.69 arc-90
LINK_LED  (via drill 0.51)
  Top 0.178: IC2.66 v44.98,45.09
  Bottom 0.254: v44.98,45.09 44.45,45.47 44.45,48.87 44.15,49.17 34.49,49.17 33.58,50.09 33.58,56.79 31.14,59.26 31.04,59.26 | 30.99,59.26 31.04,59.26 | 31.04,59.26 3.07,59.23 2.16,58.37 2.16,37.85 2.77,37.21 ETH.11
N$1
  Top 0.305: ETH.9 3.81,48.4 3.81,50.8 5.08,52.07 R101.2
N$2
  Top 0.305: X1.1 64.28,29.43 C201.2 64.07,26.16 61.01,26.16 60.88,26.04 60.88,25.21 60.24,24.56 60.24,23.96 60.23,23.96 IC1.7
N$3
  Top 0.305: X1.2 59.88,29.83 C200.2 59.43,25.46 IC1.8
N$4
  Top 0.178: IC2.76 40.98,49.04 40.97,49.58 40.97,50.38
  Top 0.203: 40.97,50.38 C110.2
  Top 0.305: X2.1 40.64,50.89 C110.2 | 40.83,50.52 C110.2 | R111.2 C110.2
N$5
  Top 0.254: R202.2 63.58,48.28 64.01,48.72 W25Q8.3
N$6
  Top 0.305: C206.2 78.78,12.01 84,12.01 85.06,10.95 JP9.1
N$7
  Top 0.813: J1.PWR D5.A
N$8
  Top 0.178: IC2.75 41.38,49.15 41.38,49.23 41.38,49.28 41.86,49.76 43.5,49.76 R111.1
  Top 0.305: 45.72,50.81 C111.1 | R111.1 C111.1 | C111.1 45.71,54.6 X2.2
N$9
  Top 0.61: C3.2 22.94,15.58 PWR_IC.1
N$10
  Top 0.305: 11.68,17.95 11.68,18.67 12.7,19.68 PWR_IC.7
  Top 0.813: R1.1 11.68,17.95
N$11
  Top 0.305: R102.1 PWR_LED.A
N$12
  Top 0.305: C4.1 16.03,15.24 16.51,15.72 16.51,18.29 16.64,18.41 PWR_IC.8
N$13
  Top 0.178: 37.32,41.92 IC2.1
  Top 0.203: 38.51,45.53 38.51,44.86 37.34,43.69 37.34,42.11 37.32,41.92
  Top 0.254: R110.2 38.51,45.53
N$14
  Top 0.254: R109.2 36.73,47.28 R110.1
N$15
  Top 0.305: R100.2 4.23,34.56 ETH.12
N$16
  Top 0.305: R4.2 13.97,21.59 14.61,22.23 | 14.61,22.23 PWR_IC.5 | R3.1 13.84,23.84 13.84,22.86 14.48,22.23 14.61,22.23
N$17
  Top 0.254: R107.2 R108.2 C102.1
N$18  (via drill 0.5)
  Top 0.305: 11.81,26.67 C5.1 12.06,25.63 15.47,25.63 15.9,25.2 v15.9,23.16 | v15.88,20.98 17.68,20.98 PWR_IC.6
  Bottom 0.305: v15.9,23.16 15.9,21.01 v15.88,20.98
N$19  (via drill 0.51)
  Top 0.305: C5.2 v16.51,26.67 | R2.1 v21.59,26.67
  Bottom 0.305: v21.59,26.67 v16.51,26.67
N$20
  Top 0.61: L2.P$1 32.89,16.38 29.23,16.38 | PWR_IC.3 27,20.95 27.51,20.45 27.51,16.59 | 25.15,15.41 25.91,15.37 27.3,16.38 27.51,16.59 | 29.23,16.38 29.21,16.36 27.74,16.36 27.51,16.59 | 29.23,16.38 D7.1
  Top 0.813: C3.1 25.15,15.41
N$22
  Top 0.305: LED_ETH_TX.A R103.1
N$23  (via drill 0.51)
  Top 0.254: v26.01,47.02 24.52,47.02 R105.2 C100.2 | v25.78,44.35 25.83,44.3 25.83,44.25 25.22,44.86 R106.2
  Bottom 0.254: v26.01,47.02 26.06,47.02 26.26,46.81 26.24,45.11 25.88,44.76 25.78,44.76 v25.78,44.35
N$24
  Top 0.305: R104.1 LED_ETH_RX.A
N$28
  Top 0.61: D6.2 29.96,18.41 37.47,18.41
  Top 0.813: 37.47,18.41 37.48,18.43 L2.P$2
N$34
  Top 0.61: R201.1 71.89,41.93 JP5.3
N$35
  Top 0.254: R203.2 61.67,46.79 61.01,47.45 W25Q8.7
N$36  (via drill 0.5)
  Top 0.813: ETH.14 ETH.13 | v15.24,53.34 L1.2
  Bottom 0.813: ETH.13 12.2,51.57 13.97,53.34 v15.24,53.34
N$37  (via drill 0.5)
  Top 0.305: v97.79,19.94 97.84,20.37 97.84,22.12 98.78,23.06 98.78,23.7 98.59,23.89 C216.2 97.22,25.41 97.02,25.41 96.52,25.4 95.92,25.4 T2.3 91.06,25.53 90.25,24.72 R210.1 | v97.31,17.45 97.31,17.4 ANT_IC.4
  Bottom 0.305: v97.79,19.94 97.79,17.73 v97.31,17.45
N$38
  Top 0.406: C217.1 101.29,16.69 103.07,14.91 ANT1.1
N$39
  Top 0.305: ANT_IC.1 95.25,12.65 96.01,11.89 96.01,9.96 C213.2
N$40  (via drill 0.5)
  Top 0.305: C214.2 96.67,27.16 v96.47,26.82 | v97.81,14.99 96.52,15 ANT_IC.3
  Bottom 0.305: v96.47,26.82 96.47,16.36 v97.81,14.99
POE1
  Top 0.61: ETH.7 15.39,32.72 15.39,32.28 D2.1 D1.2
POE2
  Top 0.61: ETH.8 17.93,32.74 D4.2 D3.1
RESET  (via drill 0.5, 0.51)
  Top 0.178: 52.06,42.01 50.93,42.04 50.34,41.5 IC2.59
  Top 0.203: R112.1 52.05,42.74 v52.5,43.19 54.09,43.19 56.9,40.39 v58.42,40.39 | IC1.29 64.93,19.45 v64.21,20.17 63.63,20.17 62.31,21.49 v62.22,21.49
  Top 0.254: R112.1 52.06,42.01
  Top 0.305: IC1.29 66.62,19.36 73.89,19.33 74.13,19.09 R200.2 74.66,19.28 75.18,19.28 77.47,16.99 S1.P$1 C206.1
  Bottom 0.203: v62.22,21.49 58.42,25.44 v58.42,40.39
  Bottom 0.305: JP2.1 59.69,11.89 62.18,14.38 62.18,18.72 63.63,20.17 v64.21,20.17
RX_ANT
  Top 0.61: RX_IC1.1 96.52,6.81 | 96.52,6.81 92.86,6.81 RX_IC2.1 | C213.1 96,7.33 96.52,6.81
RX_LED  (via drill 0.51)
  Top 0.152: IC2.72
  Top 0.178: 42.58,45.22 IC2.72
  Top 0.203: v42.62,45.26 42.58,45.22
  Top 0.254: LED_ETH_RX.C 22.86,57.15 23.22,57.51 24.18,57.51 24.74,56.95 24.74,54.36 25.45,53.65 25.45,51.36 26.36,50.44 29.57,50.44 29.62,50.39 v29.97,50.24
  Bottom 0.254: v29.97,50.24 30.84,50.24 33.53,47.55 40.49,47.55 40.95,47.09 40.95,45.57 41.25,45.26 v42.62,45.26
RXIN
  Top 0.178: IC2.6 35.18,39.9 34.87,40.21
  Top 0.203: 34.87,40.21 34.87,42.52 34.62,42.77 26.85,42.77 26.26,43.36 24.19,43.36 R106.1 20.85,44.86 19.53,46.18 17.58,46.18 16.66,45.26 16.66,40.44 17.73,39.37 ETH.6
  Top 0.254: R106.1 22.84,44.72
RXIP
  Top 0.178: 35.49,40.3 IC2.5
  Top 0.203: 22.76,46.95 22.76,46.05 | 22.76,46.05 23.01,45.8 25.78,45.8 26.75,44.83 26.75,43.56 27.08,43.23 35.03,43.23 35.31,42.95 35.31,40.49 35.49,40.3 | ETH.3 15.24,43.18 13.97,44.45 13.97,46.99 14.61,47.62 17.14,47.62 17.78,46.99 19.68,46.99 20.85,45.82 22.53,45.82 22.76,46.05
  Top 0.254: 22.72,46.77 R105.1 22.76,46.95 22.76,47.02
SEN  (via drill 0.51)
  Top 0.152: IC2.31 43.38,31.45 v42.98,31.04
  Top 0.254: v46.58,30.68 46.96,30.31 T1.3 48.33,30.38 49.48,30.38 52.07,32.97 R113.1
  Bottom 0.254: v42.98,31.04 42.98,30.99 43.28,30.68 v46.58,30.68
TX_ANT
  Top 0.406: JP6.4 75.23,25.07 78.11,27.94 94.96,27.94 C214.1
TX_LED  (via drill 0.51)
  Top 0.178: 42.62,42.11 42.18,42.76 IC2.73
  Top 0.203: v42.98,41.35 42.77,41.55 42.62,42.11
  Top 0.254: LED_ETH_TX.C 20.32,57.2 21.18,58.06 24.54,58.06 25.4,57.2 25.4,54.66 26.06,54 26.06,51.66 26.57,51.16 31.62,51.16 34.29,48.49 39.83,48.49 40.08,48.23 v40.08,45.97
  Bottom 0.254: v40.08,45.97 40.03,45.92 40.03,45.87 40.08,45.82 40.08,45.31 40.59,44.81 41.96,44.81 42.11,44.65 42.11,42.72 42.62,42.06 42.72,41.81 42.93,41.6 42.93,41.4 v42.98,41.35
TXON  (via drill 0.51)
  Top 0.178: 34.38,38.7 IC2.9
  Top 0.203: 22.63,38.51 22.63,38.86 23.04,39.27 25.15,39.27 25.81,39.93 25.81,41.12 25.91,41.22 33.3,41.22 33.58,40.95 33.58,39.5 34.38,38.7
  Top 0.254: 22.63,38.51 22.23,38.1 22.54,38.1 22.59,38.15 R107.1 22.63,38.09 v22.63,36.93 22.58,36.98
  Bottom 0.254: v22.63,36.93 22.12,36.93 22.02,37.03 21.97,37.03 21.57,37.44 21.57,38.53 19.89,40.03 19.89,43.84 19.28,44.45 ETH.2
TXOP  (via drill 0.51)
  Top 0.178: IC2.8 34.64,39.1 34.01,39.73
  Top 0.203: v21.51,39.7 24.94,39.7 25.38,40.13 25.38,41.3 25.7,41.63 33.53,41.63 34.01,41.15 34.01,39.73
  Top 0.254: R108.1 22.59,35.51 21.77,35.51 21.51,35.76 v21.51,39.7
  Bottom 0.254: v21.51,39.7 21.44,39.7 20.57,40.46 20.55,44.09 18.29,46.35 15.88,46.35 15.38,45.85 ETH.1
VCC  (via drill 0.5, 0.51)
  Top 0.152: IC2.44
  Top 0.178: 36.07,37.5 IC2.12 | IC2.18 36.5,35.1 v35.81,34.42 | v36.25,41.5 IC2.2 | IC2.44 48.24,35.5 v43.79,39.95 | C114.2 51.22,36.62 50.11,35.5 IC2.44
  Top 0.203: v35.81,36.78 36.07,37.29 36.07,37.5 33.72,37.5 C106.1 | 32.7,46.89 32.92,46.89 33.02,46.99 34.37,46.99 34.92,46.43 34.92,44.65 34.98,44.6 34.98,44.58 36.25,43.51 v36.25,41.5 | C114.2 51.22,39.47 R112.2 | R113.2 52.07,35.77 51.22,36.62
  Top 0.254: C103.1 32.7,46.89 | R102.2 17.74,51.26 8.94,51.26 | 8.94,51.26 8.13,52.07 R101.1 | R3.2 v10.16,24.13 | 8.84,51.26 8.94,51.26 | R100.1 6.86,30.48 7.62,31.24 v7.62,31.75 6.76,32.61 6.76,39.27 v8.13,40.64 6.76,42.01 6.76,49.07 8.94,51.26 | R113.2 52.09,35.16
  Top 0.305: R102.2 R103.2 R104.2 | 61.46,42.11 R203.1 | R210.2 88.07,24.47 87,23.39 87,21.06 86.89,20.95 | W25Q8.8 59,41.96 59.69,41.27 | IC1.18 60.23,21.5 60.96,22.23 60.96,23.27 IC1.6 61.07,23.39 61.07,24.38 61.19,24.5 62.45,24.5 62.63,24.31 IC1.4
  Top 0.356: 41.91,22.23 C8.A | 42.67,22.73 43.69,23.74 43.69,26.92 43.18,27.43 34.8,27.43 32.68,29.55 C109.2 33.53,30.48 34.04,30.99 34.04,33.98 34.37,34.31 35.71,34.31 v35.81,34.42
  Top 0.406: C101.1 19.18,40.64 ETH.4 | JP2.2 62.92,7.04 C204.2 | IC1.18 60.23,13.67 59.92,13.36 58.73,13.36 58.22,12.85 58.22,9.68 58.67,9.22 C203.A | IC1.4 | IC1.6 | D6.1 29.96,21.47 30.48,20.95 36.83,20.95 38.1,22.23 C7.A | v32.31,24.13 32.38,24.13 33.66,22.86 34.16,22.86 C6.A
  Top 0.61: JP2.3 JP2.2 | 37.97,22.73 C6.A | C205.2 C204.2 | 62.85,10.64 61.29,10.64 C203.A | JP2.2 62.18,6.3 | JP9.5 85.37,20.95 86.89,20.95 87,20.95 88.9,19.05 88.9,15.56 C211.2 92.07,13.65 RX_IC2.4 | JP2.2 62.23,5.84 61.04,4.65 46.15,4.65 43.81,6.99 43.81,21.59 | C7.A C8.A 42.67,22.73 43.81,21.59 | 61.58,41.81 R203.1 | 48.9,22.23 44.45,22.23 43.81,21.59 | 48.9,22.23 JP.2 | 61.56,42.01 R203.1 | C210.1 67.95,40.08 R201.2 65.84,41.9 R202.1 | JP6.3 74.13,27.61 C209.2 | C212.2 92.83,39.84 RX_IC2.5 | C207.2 100.81,39.86 RX_IC1.5 | C208.2 100.06,13.66 RX_IC1.4 | R203.1 R202.1 | R203.1 62.22,41.9 62.23,41.91 63.56,41.91 R202.1 | R203.1 61.66,41.91 60.33,41.91 59.69,41.27 59.69,39.65 59.03,38.99 55.5,38.99 54.61,38.1 54.61,27.94 48.9,22.23
  Top 0.813: C7.A 38.1,22.86 37.97,22.73 | 41.91,22.86 C8.A 42.04,22.73 | C204.2 62.85,10.64 | v74.27,16.05 74.47,16.26 R200.1
  Bottom 0.178: v43.79,39.95 42.98,39.95 42.01,40.92 40.56,40.92 39.98,41.5 v36.25,41.5
  Bottom 0.254: 35.81,34.44 v35.81,34.42 v35.81,36.78 35.81,40.46 36.25,40.89 v36.25,41.5 | v8.13,40.64 ETH.5 15.88,40.64 17.14,41.91 ETH.4
  Bottom 0.406: v7.62,31.75 7.62,26.67 v10.16,24.13 v32.31,24.13
  Bottom 0.61: JP2.3 64.77,8.41 66.8,10.44 66.8,14.38 68.5,16.08 v74.27,16.05 | JP9.5 83.49,19.38 83.49,16.79 82.75,16.05 v74.27,16.05 | RX_IC1.4 RX_IC1.5 92.86,39.83 RX_IC2.5 RX_IC2.4 | JP6.3 72.85,27.61 74.45,26.01 74.45,16.23 v74.27,16.05
VIN  (via drill 0.5, 0.51)
  Top 0.254: 13.97,17.78 R1.2
  Top 0.305: C10.+ 7.62,22.86 | v15.37,17.78 R1.2
  Top 0.406: 38.18,5.16 43.41,5.16 45.19,3.38 61.65,3.38 62.81,4.52 71.75,4.55 72.39,5.18 JP2.6
  Top 0.61: v18.14,16.15 22.52,11.77 D5.C 27.56,8 27.94,7.62 29.21,6.49 C2.+ C1.+ | 7.62,22.86 7.62,25.4 10.16,27.94 10.28,28.06 | v19.68,22.94 D4.1 18.92,28.7 18.16,27.81 14.22,27.81 D1.1 11.3,28.7 11.05,28.7 C9.1 | v25.4,17.14 25.4,19.23 24.94,19.68 PWR_IC.2
  Top 0.813: C1.+ 38.1,5.08 38.18,5.16 | C9.1 10.16,27.94
  Bottom 0.61: v19.68,22.94 18.14,21.39 18.14,18.14 17.78,17.78 | 17.78,17.78 v15.37,17.78 | v25.4,17.14 18.24,17.14 18.14,17.25 | v18.14,16.15 18.14,17.25 | 18.14,17.25 18.14,17.42 17.78,17.78

### Text on the board
tPlace: PWR | TX | RX | XTAL2 | 13 | 12 | 11 | 10 | 9 | 8 | 7 | 6 | 5 | 4 | 3 | 2 | 1 | 0 | R101 | GND | SCK | MI | MO | CS | TX | RX | L1 | R102 | R103 | R104 | C110 | C111 | C100 | R111 | W25 | C103 | R110 | GND | GND | GND | R105 | C113 | R106 | R109 | R201 | A5 | D3 | D2 | C104 | R112 | C212 | R203 | R202 | 3V3 | C101 | C105 | C207 | ANT2 | R107 | C106 | 5100 | C210 | C114 | C107 | ANT2 | R108 | C102 | C108 | R113 | GND | D1 | D4 | C109 | XTAL1 | A4 | C214 | R100 | C115 | C9 | C201 | C5 | SI2302 | R210 | R2 | C200 | R3 | R114 | C209 | C216 | GND | 3V3 | 3V3 | C215 | SI2302 | R4 | R211 | D6 | C6 | C7 | C8 | 2307 | CE | CS | S1 | TX | ANT | C10 | 2179 | R1 | SCK | MO | MO | R200 | RX | C217 | C4 | D7 | IRQ | GND | C211 | C3 | MI | L2 | C206 | DTR | D5 | C203 | C204 | C205 | ANALOG | C208 | C202 | RESET | 3V3 | 3V3 | GND | A5 | VIN | 5 | 4 | 3 | 2 | 1 | 0 | C213 | ANT | C2 | C1
bPlace: CAMGO V1.8